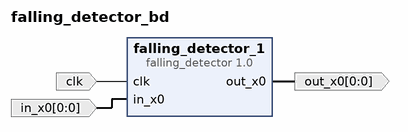
[diagram p0: block diagram of the top level]
# Vivado block design falling_detector_bd, xc7k160tfbg484-2, Vivado 2021.2
create_bd_design falling_detector_bd

create_bd_port -dir I -type clk clk
create_bd_port -dir I -from 0 -to 0 -type data in_x0
create_bd_port -dir O -from 0 -to 0 -type data out_x0

create_bd_cell -type ip -vlnv User_Company:SysGen:falling_detector:1.0 falling_detector_1

# ---- connections ----

connect_bd_net [get_bd_ports clk] [get_bd_pins falling_detector_1/clk]
connect_bd_net [get_bd_pins falling_detector_1/out_x0] [get_bd_ports out_x0]
connect_bd_net -net in_x0_1 [get_bd_ports in_x0] [get_bd_pins falling_detector_1/in_x0]

validate_bd_design
save_bd_design
